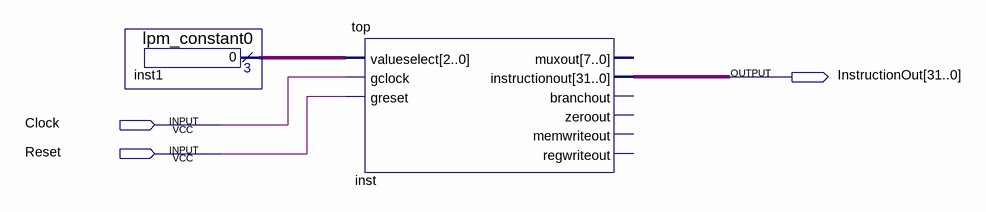
[diagram p0: schematic sheet]
// Quartus schematic Toplevelblock.bdf as structural Verilog: 2 symbols, 3 pins
module Toplevelblock (
  input  Clock,
  input  Reset,
  output [31:0] InstructionOut
);

  wire [2:0] inst1_result;

  lpm_constant0 inst1 (.result(inst1_result));
  top inst (
    .valueselect(inst1_result), .gclock(Clock), .greset(Reset), .instructionout(InstructionOut));  // open: muxout, branchout, zeroout, memwriteout, regwriteout
endmodule
